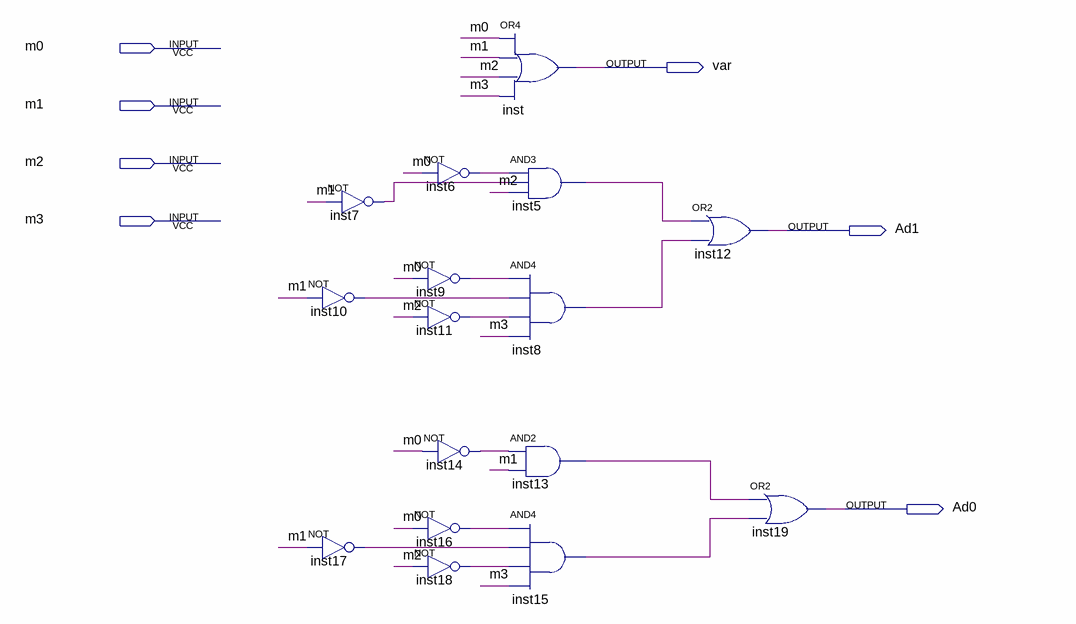
[diagram p0: schematic sheet]
// Quartus schematic encoderDevresi.bdf as structural Verilog: 16 symbols, 7 pins
module encoderDevresi (
  input  m0,
  input  m1,
  input  m2,
  input  m3,
  output \var ,
  output Ad1,
  output Ad0
);

  wire inst5_out, inst6_out, inst7_out, inst8_out, inst9_out, inst10_out, inst11_out, inst13_out, inst14_out,
       inst15_out, inst16_out, inst17_out, inst18_out;

  not inst10 (inst10_out, m1);
  not inst17 (inst17_out, m1);
  not inst7 (inst7_out, m1);
  not inst6 (inst6_out, m0);
  not inst9 (inst9_out, m0);
  not inst11 (inst11_out, m2);
  not inst14 (inst14_out, m0);
  not inst16 (inst16_out, m0);
  not inst18 (inst18_out, m2);
  or inst (\var , m0, m1, m2, m3);
  and inst5 (inst5_out, inst6_out, inst7_out, m2);
  and inst8 (inst8_out, inst9_out, inst10_out, inst11_out, m3);
  and inst13 (inst13_out, inst14_out, m1);
  and inst15 (inst15_out, inst16_out, inst17_out, inst18_out, m3);
  or inst12 (Ad1, inst5_out, inst8_out);
  or inst19 (Ad0, inst13_out, inst15_out);
endmodule
